# EAGLE schematic Schematic (EAGLE 9.2.2)
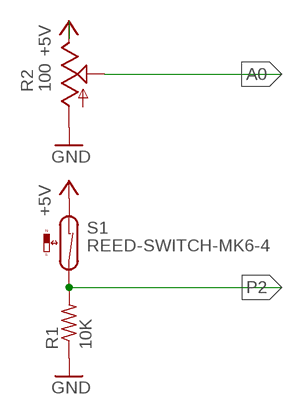
[diagram p0: schematic, sheet 1]

## Parts
R1  10K  R-US_0204/5  [0204/5]
R2  100  TRIM_US-CIP20C-4MM  [CIP20C-4MM]
S1  REED-SWITCH-MK6-4  [MK6-4]

## Nets
+5V: R2.E S1.1
A0: R2.S
GND: R1.1 R2.A
P2: R1.2 S1.2

## Library data of the parts
R1 = rcl:R-US_: RESISTOR, American symbol; SPICEPREFIX: R
R2 = pot:TRIM_US-: POTENTIOMETER
S1 = switch-reed:REED-SWITCH-: Reed Sensor; OC_FARNELL: unknown